# Altium schematic sheet I2C.SchDoc
size A4; SheetNumber: 11; SheetTotal: 14
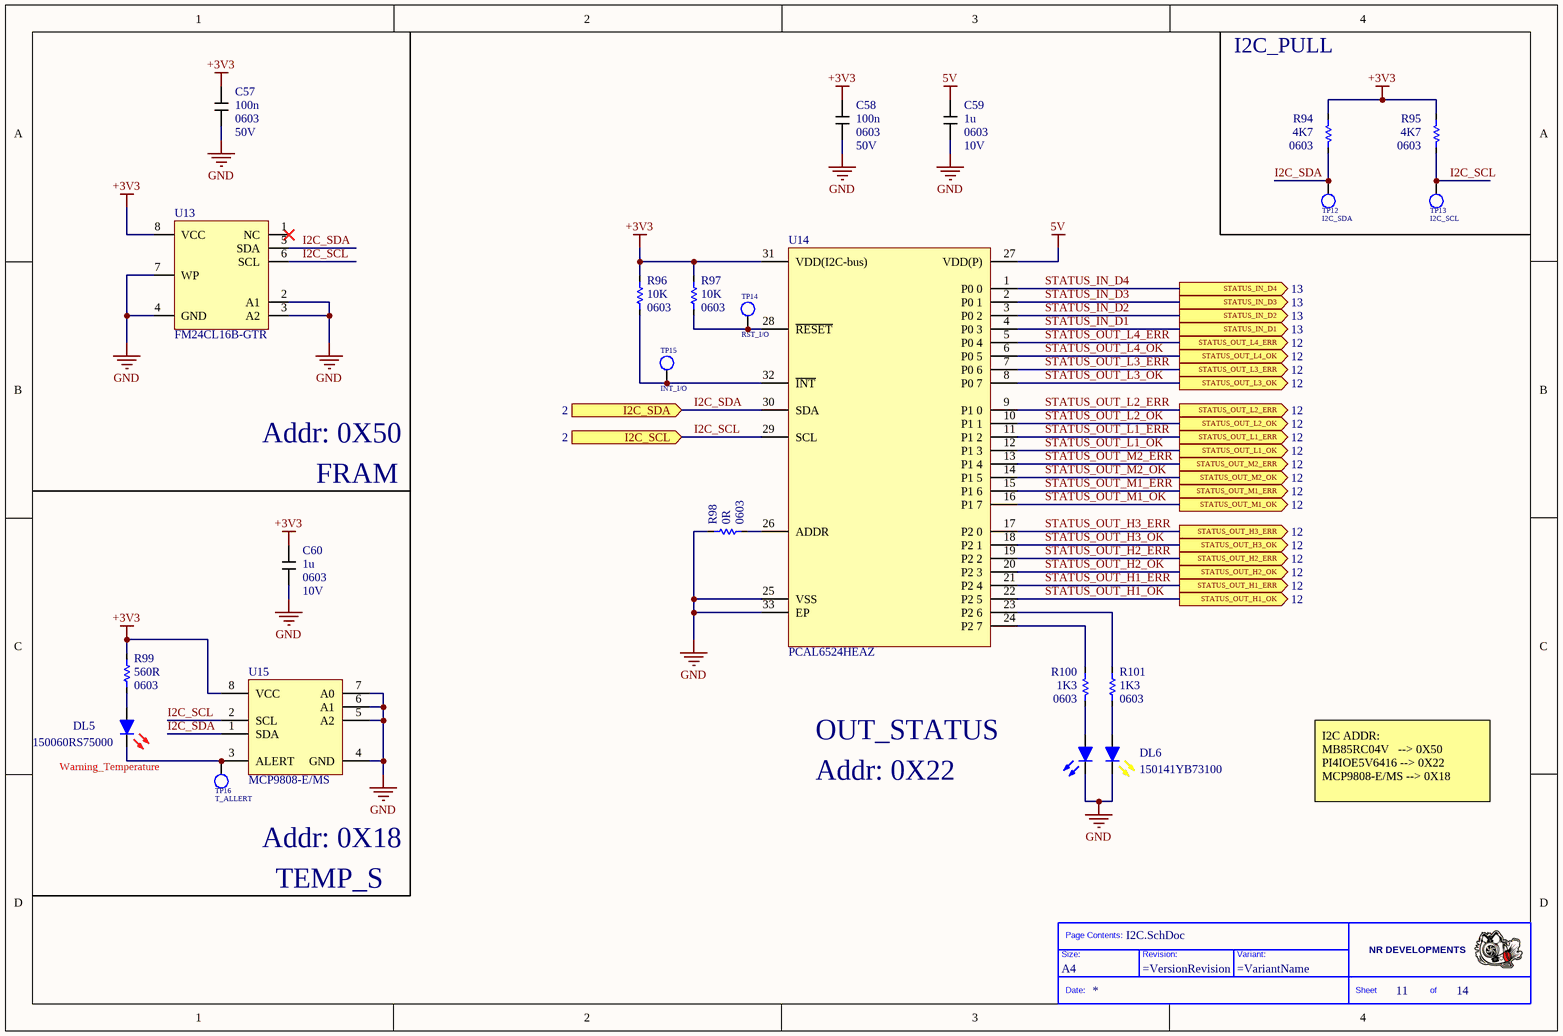
[diagram p0: I2C.SchDoc]

## Parts
*  Size: A4  (hidden comment: Title_Block)  (graphical)
C57  value 100n  Case: 0603  Voltage: 50V  [CAPC1608X09M]  (hidden comment: CAP)
C58  value 100n  Case: 0603  Voltage: 50V  [CAPC1608X09M]  (hidden comment: CAP)
C59  value 1u  Case: 0603  Voltage: 10V  [CAPC1608X09M]  (hidden comment: CAP)
C60  value 1u  Case: 0603  Voltage: 10V  [CAPC1608X09M]  (hidden comment: CAP)
DL5  value 150060RS75000  [LED0603]  (hidden comment: LED_Red)
DL6  value 150141YB73100  [WURTH-SBTW_3528]  (hidden comment: LED_Yellow_Blue)
R94  value 4K7  Case: 0603  [RESC1608X06M]  (hidden comment: Res)
R95  value 4K7  Case: 0603  [RESC1608X06M]  (hidden comment: Res)
R96  value 10K  Case: 0603  [RESC1608X06M]  (hidden comment: Res)
R97  value 10K  Case: 0603  [RESC1608X06M]  (hidden comment: Res)
R98  value 0R  Case: 0603  [RESC1608X06M]  (hidden comment: Res)
R99  value 560R  Case: 0603  [RESC1608X06M]  (hidden comment: Res)
R100  value 1K3  Case: 0603  [RESC1608X06M]  (hidden comment: Res)
R101  value 1K3  Case: 0603  [RESC1608X06M]  (hidden comment: Res)
TP12  I2C_SDA  [TP_c200]
TP13  I2C_SCL  [TP_c200]
TP14  RST_I/O  [TP_c200]
TP15  INT_I/O  [TP_c200]
TP16  T_ALLERT  [TP_c200]
U13  value FM24CL16B-GTR  [SOIC127P600X175-8N]  (hidden comment: MB85RC04V)
U14  PCAL6524HEAZ  [FP-SOT1426-1-IPC_A]
U15  MCP9808-E/MS  [MCHP-MSOP-MS8_N]

## Ports
I2C_SCL (in, see 2), I2C_SDA (in, see 2), STATUS_IN_D1 (out, see 13), STATUS_IN_D2 (out, see 13), STATUS_IN_D3 (out, see 13), STATUS_IN_D4 (out, see 13), STATUS_OUT_H1_ERR (out, see 12), STATUS_OUT_H1_OK (out, see 12), STATUS_OUT_H2_ERR (out, see 12), STATUS_OUT_H2_OK (out, see 12), STATUS_OUT_H3_ERR (out, see 12), STATUS_OUT_H3_OK (out, see 12), STATUS_OUT_L1_ERR (out, see 12), STATUS_OUT_L1_OK (out, see 12), STATUS_OUT_L2_ERR (out, see 12), STATUS_OUT_L2_OK (out, see 12), STATUS_OUT_L3_ERR (out, see 12), STATUS_OUT_L3_OK (out, see 12), STATUS_OUT_L4_ERR (out, see 12), STATUS_OUT_L4_OK (out, see 12), STATUS_OUT_M1_ERR (out, see 12), STATUS_OUT_M1_OK (out, see 12), STATUS_OUT_M2_ERR (out, see 12), STATUS_OUT_M2_OK (out, see 12)

## Nets
5V: C59.1 U14.27(VDD(P))
+3V3: C57.1 C58.1 C60.1 R94.2 R95.2 R96.2 R97.2 R99.2 U13.8(VCC) U14.31(VDD(I2C-bus)) U15.8(VCC)
GND: C57.2 C58.2 C59.2 C60.2 DL6.C1 DL6.C2 R98.2 U13.2(A1) U13.3(A2) U13.4(GND) U13.7(WP) U14.25(VSS) U14.33(EP) U15.4(GND) U15.5(A2) U15.6(A1) U15.7(A0)
I2C_SCL: R95.1 TP13.1 U13.6(SCL) U14.29(SCL) U15.2(SCL) ; port I2C_SCL
I2C_SDA: R94.1 TP12.1 U13.5(SDA) U14.30(SDA) U15.1(SDA) ; port I2C_SDA
STATUS_IN_D1: U14.4(P0_3) ; port STATUS_IN_D1
STATUS_IN_D2: U14.3(P0_2) ; port STATUS_IN_D2
STATUS_IN_D3: U14.2(P0_1) ; port STATUS_IN_D3
STATUS_IN_D4: U14.1(P0_0) ; port STATUS_IN_D4
STATUS_OUT_H1_ERR: U14.21(P2_4) ; port STATUS_OUT_H1_ERR
STATUS_OUT_H1_OK: U14.22(P2_5) ; port STATUS_OUT_H1_OK
STATUS_OUT_H2_ERR: U14.19(P2_2) ; port STATUS_OUT_H2_ERR
STATUS_OUT_H2_OK: U14.20(P2_3) ; port STATUS_OUT_H2_OK
STATUS_OUT_H3_ERR: U14.17(P2_0) ; port STATUS_OUT_H3_ERR
STATUS_OUT_H3_OK: U14.18(P2_1) ; port STATUS_OUT_H3_OK
STATUS_OUT_L1_ERR: U14.11(P1_2) ; port STATUS_OUT_L1_ERR
STATUS_OUT_L1_OK: U14.12(P1_3) ; port STATUS_OUT_L1_OK
STATUS_OUT_L2_ERR: U14.9(P1_0) ; port STATUS_OUT_L2_ERR
STATUS_OUT_L2_OK: U14.10(P1_1) ; port STATUS_OUT_L2_OK
STATUS_OUT_L3_ERR: U14.7(P0_6) ; port STATUS_OUT_L3_ERR
STATUS_OUT_L3_OK: U14.8(P0_7) ; port STATUS_OUT_L3_OK
STATUS_OUT_L4_ERR: U14.5(P0_4) ; port STATUS_OUT_L4_ERR
STATUS_OUT_L4_OK: U14.6(P0_5) ; port STATUS_OUT_L4_OK
STATUS_OUT_M1_ERR: U14.15(P1_6) ; port STATUS_OUT_M1_ERR
STATUS_OUT_M1_OK: U14.16(P1_7) ; port STATUS_OUT_M1_OK
STATUS_OUT_M2_ERR: U14.13(P1_4) ; port STATUS_OUT_M2_ERR
STATUS_OUT_M2_OK: U14.14(P1_5) ; port STATUS_OUT_M2_OK
NetDL5_A: DL5.A R99.1
NetDL5_C: DL5.C TP16.1 U15.3(ALERT)
NetDL6_A1: DL6.A1 R101.1
NetDL6_A2: DL6.A2 R100.1
NetR96_1: R96.1 TP15.1 U14.32(~{INT})
NetR97_1: R97.1 TP14.1 U14.28(~{RESET})
NetR98_1: R98.1 U14.26(ADDR)
NetR100_2: R100.2 U14.24(P2_7)
NetR101_2: R101.2 U14.23(P2_6)

Not connected (* = marked no-connect by the designer): U13 1(NC)*

## Notes on the sheet
- I2C_PULL
- Addr: 0X50
- FRAM
- (near DL5) Warning_Temperature
- OUT_STATUS
- Addr: 0X22
- Addr: 0X18
- I2C ADDR:
  MB85RC04V   --> 0X50
  PI4IOE5V6416 --> 0X22
  MCP9808-E/MS --> 0X18
- TEMP_S
- (in symbol Title_Block) Page Contents:; NR DEVELOPMENTS; Size:; Revision:; Variant:; Date:; Sheet; of

## Library data of the parts
C57 C58 = CAP: Manufacturer: KEMET; PartNumber: C0603C104K5RACTU
C59 C60 = CAP: Manufacturer: KEMET; PartNumber: C0603C105K8RACTU
DL5 = LED_Red: Manufacturer: Wurth Elektronik; PartNumber: 150060RS75000; Case: 0603
DL6 = LED_Yellow_Blue: Led Yellow - Blue 3528; Manufacturer: Wurth; PartNumber: 150141YB73100; Case: 3528
R94 R95 = Resistor: Manufacturer: Vishay; PartNumber: CRCW06034K70FKEB
R96 R97 = Resistor: Manufacturer: Vishay; PartNumber: CRCW060310K0FKEA
R98 = Resistor: Manufacturer: Vishay; PartNumber: CRCW06030000Z0EAC
R99 = Resistor: Manufacturer: Vishay; PartNumber: RC0603FR-07560RL
R100 R101 = Resistor: Manufacturer: Vishay; PartNumber: RC0603FR-071K3L
TP12-TP16 = Test_Point
U13 = MB85RC04V: F-RAM 4kbit FRAM, I2C, 3.0V 5.5V - SOP8 T&R; Manufacturer: Infineon Technologies; PartNumber: FM24CL16B-GTR
U14 = PCAL6524HEAZ: IC EXPANDER 24B 32HUQFN; Manufacturer: NXP Semiconductors; PartNumber: PCAL6524HEAZ; Case: HUQFN-32; Value: PCAL6524HEAZ
U15 = MCP9808-E/MS: + / - 0.5 degC Maximum Accuracy Digital Temperature Sensor, 400 uA, 2.7 to 5.5 V, -40 to 125 degC, 8-pin MSOP (MS8), Tube; Manufacturer: Microchip; PartNumber: MCP9808-E/MS; Case: MSOP-8; Value: MCP9808-E/MS